# Altium schematic sheet Tree.schdoc
size 243 x 223 mm
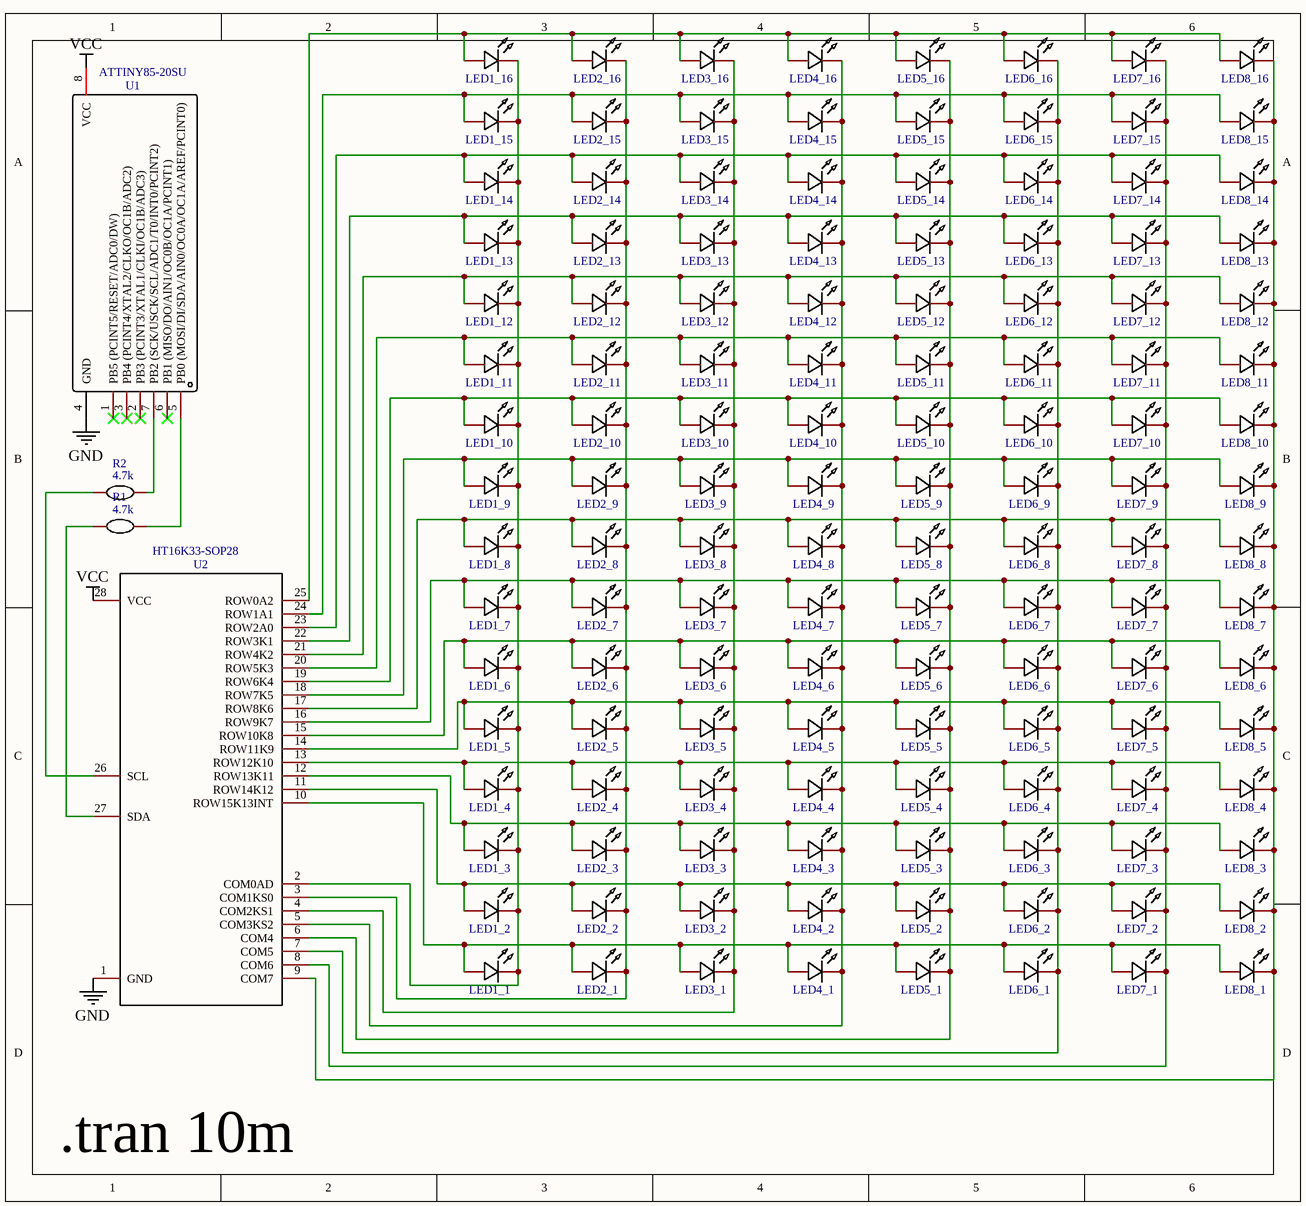
[diagram p0: Tree.schdoc]

## Parts
LED1_1  19-217/GHC-YR1S2/3T  (value not drawn)
LED1_2  19-217/GHC-YR1S2/3T  (value not drawn)
LED1_3  19-217/GHC-YR1S2/3T  (value not drawn)
LED1_4  19-217/GHC-YR1S2/3T  (value not drawn)
LED1_5  19-217/GHC-YR1S2/3T  (value not drawn)
LED1_6  19-217/GHC-YR1S2/3T  (value not drawn)
LED1_7  19-217/GHC-YR1S2/3T  (value not drawn)
LED1_8  19-217/GHC-YR1S2/3T  (value not drawn)
LED1_9  19-217/GHC-YR1S2/3T  (value not drawn)
LED1_10  19-217/GHC-YR1S2/3T  (value not drawn)
LED1_11  19-217/BHC-ZL1M2RY/3T  (value not drawn)
LED1_12  19-217/BHC-ZL1M2RY/3T  (value not drawn)
LED1_13  19-217/BHC-ZL1M2RY/3T  (value not drawn)
LED1_14  19-217/BHC-ZL1M2RY/3T  (value not drawn)
LED1_15  19-217/BHC-ZL1M2RY/3T  (value not drawn)
LED1_16  19-217/R6C-AL1M2VY/3T  (value not drawn)
LED2_1  19-217/GHC-YR1S2/3T  (value not drawn)
LED2_2  19-217/GHC-YR1S2/3T  (value not drawn)
LED2_3  19-217/GHC-YR1S2/3T  (value not drawn)
LED2_4  19-217/GHC-YR1S2/3T  (value not drawn)
LED2_5  19-217/GHC-YR1S2/3T  (value not drawn)
LED2_6  19-217/GHC-YR1S2/3T  (value not drawn)
LED2_7  19-217/GHC-YR1S2/3T  (value not drawn)
LED2_8  19-217/GHC-YR1S2/3T  (value not drawn)
LED2_9  19-217/GHC-YR1S2/3T  (value not drawn)
LED2_10  19-217/GHC-YR1S2/3T  (value not drawn)
LED2_11  19-217/BHC-ZL1M2RY/3T  (value not drawn)
LED2_12  19-217/BHC-ZL1M2RY/3T  (value not drawn)
LED2_13  19-217/BHC-ZL1M2RY/3T  (value not drawn)
LED2_14  19-217/BHC-ZL1M2RY/3T  (value not drawn)
LED2_15  19-217/BHC-ZL1M2RY/3T  (value not drawn)
LED2_16  19-217/R6C-AL1M2VY/3T  (value not drawn)
LED3_1  19-217/GHC-YR1S2/3T  (value not drawn)
LED3_2  19-217/GHC-YR1S2/3T  (value not drawn)
LED3_3  19-217/GHC-YR1S2/3T  (value not drawn)
LED3_4  19-217/GHC-YR1S2/3T  (value not drawn)
LED3_5  19-217/GHC-YR1S2/3T  (value not drawn)
LED3_6  19-217/GHC-YR1S2/3T  (value not drawn)
LED3_7  19-217/GHC-YR1S2/3T  (value not drawn)
LED3_8  19-217/GHC-YR1S2/3T  (value not drawn)
LED3_9  19-217/GHC-YR1S2/3T  (value not drawn)
LED3_10  19-217/GHC-YR1S2/3T  (value not drawn)
LED3_11  19-217/BHC-ZL1M2RY/3T  (value not drawn)
LED3_12  19-217/BHC-ZL1M2RY/3T  (value not drawn)
LED3_13  19-217/BHC-ZL1M2RY/3T  (value not drawn)
LED3_14  19-217/BHC-ZL1M2RY/3T  (value not drawn)
LED3_15  19-217/BHC-ZL1M2RY/3T  (value not drawn)
LED3_16  19-217/R6C-AL1M2VY/3T  (value not drawn)
LED4_1  19-217/GHC-YR1S2/3T  (value not drawn)
LED4_2  19-217/GHC-YR1S2/3T  (value not drawn)
LED4_3  19-217/GHC-YR1S2/3T  (value not drawn)
LED4_4  19-217/GHC-YR1S2/3T  (value not drawn)
LED4_5  19-217/GHC-YR1S2/3T  (value not drawn)
LED4_6  19-217/GHC-YR1S2/3T  (value not drawn)
LED4_7  19-217/GHC-YR1S2/3T  (value not drawn)
LED4_8  19-217/GHC-YR1S2/3T  (value not drawn)
LED4_9  19-217/GHC-YR1S2/3T  (value not drawn)
LED4_10  19-217/GHC-YR1S2/3T  (value not drawn)
LED4_11  19-217/BHC-ZL1M2RY/3T  (value not drawn)
LED4_12  19-217/BHC-ZL1M2RY/3T  (value not drawn)
LED4_13  19-217/BHC-ZL1M2RY/3T  (value not drawn)
LED4_14  19-217/BHC-ZL1M2RY/3T  (value not drawn)
LED4_15  19-217/BHC-ZL1M2RY/3T  (value not drawn)
LED4_16  19-217/R6C-AL1M2VY/3T  (value not drawn)
LED5_1  19-217/GHC-YR1S2/3T  (value not drawn)
LED5_2  19-217/GHC-YR1S2/3T  (value not drawn)
LED5_3  19-217/GHC-YR1S2/3T  (value not drawn)
LED5_4  19-217/GHC-YR1S2/3T  (value not drawn)
LED5_5  19-217/GHC-YR1S2/3T  (value not drawn)
LED5_6  19-217/GHC-YR1S2/3T  (value not drawn)
LED5_7  19-217/GHC-YR1S2/3T  (value not drawn)
LED5_8  19-217/GHC-YR1S2/3T  (value not drawn)
LED5_9  19-217/GHC-YR1S2/3T  (value not drawn)
LED5_10  19-217/GHC-YR1S2/3T  (value not drawn)
LED5_11  19-217/BHC-ZL1M2RY/3T  (value not drawn)
LED5_12  19-217/BHC-ZL1M2RY/3T  (value not drawn)
LED5_13  19-217/BHC-ZL1M2RY/3T  (value not drawn)
LED5_14  19-217/BHC-ZL1M2RY/3T  (value not drawn)
LED5_15  19-217/BHC-ZL1M2RY/3T  (value not drawn)
LED5_16  19-217/R6C-AL1M2VY/3T  (value not drawn)
LED6_1  19-217/GHC-YR1S2/3T  (value not drawn)
LED6_2  19-217/GHC-YR1S2/3T  (value not drawn)
LED6_3  19-217/GHC-YR1S2/3T  (value not drawn)
LED6_4  19-217/GHC-YR1S2/3T  (value not drawn)
LED6_5  19-217/GHC-YR1S2/3T  (value not drawn)
LED6_6  19-217/GHC-YR1S2/3T  (value not drawn)
LED6_7  19-217/GHC-YR1S2/3T  (value not drawn)
LED6_8  19-217/GHC-YR1S2/3T  (value not drawn)
LED6_9  19-217/GHC-YR1S2/3T  (value not drawn)
LED6_10  19-217/GHC-YR1S2/3T  (value not drawn)
LED6_11  19-217/BHC-ZL1M2RY/3T  (value not drawn)
LED6_12  19-217/BHC-ZL1M2RY/3T  (value not drawn)
LED6_13  19-217/BHC-ZL1M2RY/3T  (value not drawn)
LED6_14  19-217/BHC-ZL1M2RY/3T  (value not drawn)
LED6_15  19-217/BHC-ZL1M2RY/3T  (value not drawn)
LED6_16  19-217/R6C-AL1M2VY/3T  (value not drawn)
LED7_1  19-217/GHC-YR1S2/3T  (value not drawn)
LED7_2  19-217/GHC-YR1S2/3T  (value not drawn)
LED7_3  19-217/GHC-YR1S2/3T  (value not drawn)
LED7_4  19-217/GHC-YR1S2/3T  (value not drawn)
LED7_5  19-217/GHC-YR1S2/3T  (value not drawn)
LED7_6  19-217/GHC-YR1S2/3T  (value not drawn)
LED7_7  19-217/GHC-YR1S2/3T  (value not drawn)
LED7_8  19-217/GHC-YR1S2/3T  (value not drawn)
LED7_9  19-217/GHC-YR1S2/3T  (value not drawn)
LED7_10  19-217/GHC-YR1S2/3T  (value not drawn)
LED7_11  19-217/BHC-ZL1M2RY/3T  (value not drawn)
LED7_12  19-217/BHC-ZL1M2RY/3T  (value not drawn)
LED7_13  19-217/BHC-ZL1M2RY/3T  (value not drawn)
LED7_14  19-217/BHC-ZL1M2RY/3T  (value not drawn)
LED7_15  19-217/BHC-ZL1M2RY/3T  (value not drawn)
LED7_16  19-217/R6C-AL1M2VY/3T  (value not drawn)
LED8_1  19-217/GHC-YR1S2/3T  (value not drawn)
LED8_2  19-217/GHC-YR1S2/3T  (value not drawn)
LED8_3  19-217/GHC-YR1S2/3T  (value not drawn)
LED8_4  19-217/GHC-YR1S2/3T  (value not drawn)
LED8_5  19-217/GHC-YR1S2/3T  (value not drawn)
LED8_6  19-217/GHC-YR1S2/3T  (value not drawn)
LED8_7  19-217/GHC-YR1S2/3T  (value not drawn)
LED8_8  19-217/GHC-YR1S2/3T  (value not drawn)
LED8_9  19-217/GHC-YR1S2/3T  (value not drawn)
LED8_10  19-217/GHC-YR1S2/3T  (value not drawn)
LED8_11  19-217/BHC-ZL1M2RY/3T  (value not drawn)
LED8_12  19-217/BHC-ZL1M2RY/3T  (value not drawn)
LED8_13  19-217/BHC-ZL1M2RY/3T  (value not drawn)
LED8_14  19-217/BHC-ZL1M2RY/3T  (value not drawn)
LED8_15  19-217/BHC-ZL1M2RY/3T  (value not drawn)
LED8_16  19-217/R6C-AL1M2VY/3T  (value not drawn)
R1  4.7k
R2  4.7k
U1  ATTINY85-20SU
U2  HT16K33-SOP28

## Nets
GND: U1.4(GND) U2.1(GND)
VCC: U1.8(VCC) U2.28(VCC)
NetLED1_1_1: LED1_1.1 LED2_1.1 LED3_1.1 LED4_1.1 LED5_1.1 LED6_1.1 LED7_1.1 LED8_1.1 U2.10(ROW15K13INT)
NetLED1_1_2: LED1_1.2 LED1_2.2 LED1_3.2 LED1_4.2 LED1_5.2 LED1_6.2 LED1_7.2 LED1_8.2 LED1_9.2 LED1_10.2 LED1_11.2 LED1_12.2 LED1_13.2 LED1_14.2 LED1_15.2 LED1_16.2 U2.2(COM0AD)
NetLED1_2_1: LED1_2.1 LED2_2.1 LED3_2.1 LED4_2.1 LED5_2.1 LED6_2.1 LED7_2.1 LED8_2.1 U2.11(ROW14K12)
NetLED1_3_1: LED1_3.1 LED2_3.1 LED3_3.1 LED4_3.1 LED5_3.1 LED6_3.1 LED7_3.1 LED8_3.1 U2.12(ROW13K11)
NetLED1_4_1: LED1_4.1 LED2_4.1 LED3_4.1 LED4_4.1 LED5_4.1 LED6_4.1 LED7_4.1 LED8_4.1 U2.13(ROW12K10)
NetLED1_5_1: LED1_5.1 LED2_5.1 LED3_5.1 LED4_5.1 LED5_5.1 LED6_5.1 LED7_5.1 LED8_5.1 U2.14(ROW11K9)
NetLED1_6_1: LED1_6.1 LED2_6.1 LED3_6.1 LED4_6.1 LED5_6.1 LED6_6.1 LED7_6.1 LED8_6.1 U2.15(ROW10K8)
NetLED1_7_1: LED1_7.1 LED2_7.1 LED3_7.1 LED4_7.1 LED5_7.1 LED6_7.1 LED7_7.1 LED8_7.1 U2.16(ROW9K7)
NetLED1_8_1: LED1_8.1 LED2_8.1 LED3_8.1 LED4_8.1 LED5_8.1 LED6_8.1 LED7_8.1 LED8_8.1 U2.17(ROW8K6)
NetLED1_9_1: LED1_9.1 LED2_9.1 LED3_9.1 LED4_9.1 LED5_9.1 LED6_9.1 LED7_9.1 LED8_9.1 U2.18(ROW7K5)
NetLED1_10_1: LED1_10.1 LED2_10.1 LED3_10.1 LED4_10.1 LED5_10.1 LED6_10.1 LED7_10.1 LED8_10.1 U2.19(ROW6K4)
NetLED1_11_1: LED1_11.1 LED2_11.1 LED3_11.1 LED4_11.1 LED5_11.1 LED6_11.1 LED7_11.1 LED8_11.1 U2.20(ROW5K3)
NetLED1_12_1: LED1_12.1 LED2_12.1 LED3_12.1 LED4_12.1 LED5_12.1 LED6_12.1 LED7_12.1 LED8_12.1 U2.21(ROW4K2)
NetLED1_13_1: LED1_13.1 LED2_13.1 LED3_13.1 LED4_13.1 LED5_13.1 LED6_13.1 LED7_13.1 LED8_13.1 U2.22(ROW3K1)
NetLED1_14_1: LED1_14.1 LED2_14.1 LED3_14.1 LED4_14.1 LED5_14.1 LED6_14.1 LED7_14.1 LED8_14.1 U2.23(ROW2A0)
NetLED1_15_1: LED1_15.1 LED2_15.1 LED3_15.1 LED4_15.1 LED5_15.1 LED6_15.1 LED7_15.1 LED8_15.1 U2.24(ROW1A1)
NetLED1_16_1: LED1_16.1 LED2_16.1 LED3_16.1 LED4_16.1 LED5_16.1 LED6_16.1 LED7_16.1 LED8_16.1 U2.25(ROW0A2)
NetLED2_1_2: LED2_1.2 LED2_2.2 LED2_3.2 LED2_4.2 LED2_5.2 LED2_6.2 LED2_7.2 LED2_8.2 LED2_9.2 LED2_10.2 LED2_11.2 LED2_12.2 LED2_13.2 LED2_14.2 LED2_15.2 LED2_16.2 U2.3(COM1KS0)
NetLED3_1_2: LED3_1.2 LED3_2.2 LED3_3.2 LED3_4.2 LED3_5.2 LED3_6.2 LED3_7.2 LED3_8.2 LED3_9.2 LED3_10.2 LED3_11.2 LED3_12.2 LED3_13.2 LED3_14.2 LED3_15.2 LED3_16.2 U2.4(COM2KS1)
NetLED4_1_2: LED4_1.2 LED4_2.2 LED4_3.2 LED4_4.2 LED4_5.2 LED4_6.2 LED4_7.2 LED4_8.2 LED4_9.2 LED4_10.2 LED4_11.2 LED4_12.2 LED4_13.2 LED4_14.2 LED4_15.2 LED4_16.2 U2.5(COM3KS2)
NetLED5_1_2: LED5_1.2 LED5_2.2 LED5_3.2 LED5_4.2 LED5_5.2 LED5_6.2 LED5_7.2 LED5_8.2 LED5_9.2 LED5_10.2 LED5_11.2 LED5_12.2 LED5_13.2 LED5_14.2 LED5_15.2 LED5_16.2 U2.6(COM4)
NetLED6_1_2: LED6_1.2 LED6_2.2 LED6_3.2 LED6_4.2 LED6_5.2 LED6_6.2 LED6_7.2 LED6_8.2 LED6_9.2 LED6_10.2 LED6_11.2 LED6_12.2 LED6_13.2 LED6_14.2 LED6_15.2 LED6_16.2 U2.7(COM5)
NetLED7_1_2: LED7_1.2 LED7_2.2 LED7_3.2 LED7_4.2 LED7_5.2 LED7_6.2 LED7_7.2 LED7_8.2 LED7_9.2 LED7_10.2 LED7_11.2 LED7_12.2 LED7_13.2 LED7_14.2 LED7_15.2 LED7_16.2 U2.8(COM6)
NetLED8_1_2: LED8_1.2 LED8_2.2 LED8_3.2 LED8_4.2 LED8_5.2 LED8_6.2 LED8_7.2 LED8_8.2 LED8_9.2 LED8_10.2 LED8_11.2 LED8_12.2 LED8_13.2 LED8_14.2 LED8_15.2 LED8_16.2 U2.9(COM7)
NetR1_1: R1.1 U2.27(SDA)
NetR1_2: R1.2 U1.5(PB0_(MOSI/DI/SDA/AIN0/OC0A/OC1A/AREF/PCINT0))
NetR2_1: R2.1 U2.26(SCL)
NetR2_2: R2.2 U1.7(PB2_(SCK/USCK/SCL/ADC1/T0/INT0/PCINT2))

Not connected (* = marked no-connect by the designer): U1 1(PB5_(PCINT5/RESET/ADC0/DW))* 2(PB3_(PCINT3/XTAL1/CLKI/OC1B/ADC3))* 3(PB4_(PCINT4/XTAL2/CLKO/OC1B/ADC2))* 6(PB1_(MISO/DO/AIN1/OC0B/OC1A/PCINT1))*

## Notes on the sheet
- .tran 10m

## Library data of the parts
LED1_1 = 19-217/GHC-YR1S2/3T: Manufacturer: EVERLIGHT(台湾亿光); Name: GREEN; Convert to PCB: yes; Origin Footprint: LED0402-R-RD; Symbol: GREEN; Device: 19-217/GHC-YR1S2/3T; Manufacturer Part: 19-217/GHC-YR1S2/3T; Supplier Part: C72043; Supplier: LCSC; Add into BOM: yes
LED1_2-LED1_10 LED2_1-LED2_10 LED3_1-LED3_10 LED4_1-LED4_10 LED5_1-LED5_10 LED6_1-LED6_10 LED7_1-LED7_10 LED8_1-LED8_10 = 19-217/GHC-YR1S2/3T: Manufacturer: EVERLIGHT(台湾亿光); Name: LED-0603_G; Symbol: GREEN; Convert to PCB: yes; Origin Footprint: LED0402-R-RD; Device: 19-217/GHC-YR1S2/3T; Manufacturer Part: 19-217/GHC-YR1S2/3T; Supplier Part: C72043; Supplier: LCSC; Add into BOM: yes
LED1_11-LED1_15 LED2_11-LED2_15 LED3_11-LED3_15 LED4_11-LED4_15 LED5_11-LED5_15 LED6_11-LED6_15 LED7_11-LED7_15 LED8_11-LED8_15 = 19-217/BHC-ZL1M2RY/3T: Manufacturer: EVERLIGHT(台湾亿光); Name: LED-0603_B; Convert to PCB: yes; Origin Footprint: LED0402-R-RD; Symbol: LED-0603_B; Device: 19-217/BHC-ZL1M2RY/3T; Manufacturer Part: 19-217/BHC-ZL1M2RY/3T; Supplier Part: C72041; Supplier: LCSC; Add into BOM: yes
LED1_16 LED2_16 LED3_16 LED4_16 LED5_16 LED6_16 LED7_16 LED8_16 = 19-217/R6C-AL1M2VY/3T: Manufacturer: EVERLIGHT(台湾亿光); Name: LED-0603_R; Convert to PCB: yes; Origin Footprint: LED0402-R-RD; Symbol: LED-0603_R; Device: 19-217/R6C-AL1M2VY/3T; Manufacturer Part: 19-217/R6C-AL1M2VY/3T; Supplier Part: C72044; Supplier: LCSC; Add into BOM: yes
R1 R2 = 4.7k: Convert to PCB: yes; Origin Footprint: R0603; Name: 4.7k; Symbol: 4.7k; Device: 4.7k; Add into BOM: yes
U1 = ATTINY85-20SU: Manufacturer: MICROCHIP; Convert to PCB: yes; Origin Footprint: SOIC-8_L5.3-W5.3-P1.27-LS8.0-BL; Name: ATTINY85-20SU; Symbol: ATTINY85-20SU; Device: ATTINY85-20SU; Supplier: LCSC; Manufacturer Part: ATTINY85-20SU; Supplier Part: C89852; JLCPCB Part Class: Extend; Add into BOM: yes
U2 = HT16K33-SOP28: Convert to PCB: yes; Origin Footprint: SOIC127P1031X264-28N; Name: HT16K33-SOP28; Symbol: HT16K33-SOP28; Device: HT16K33-SOP28; Add into BOM: yes